# Altium schematic sheet GZ7_1_x-TEL.SchDoc: GZ8-4-0
size B; SheetNumber: 10; SheetTotal: 10
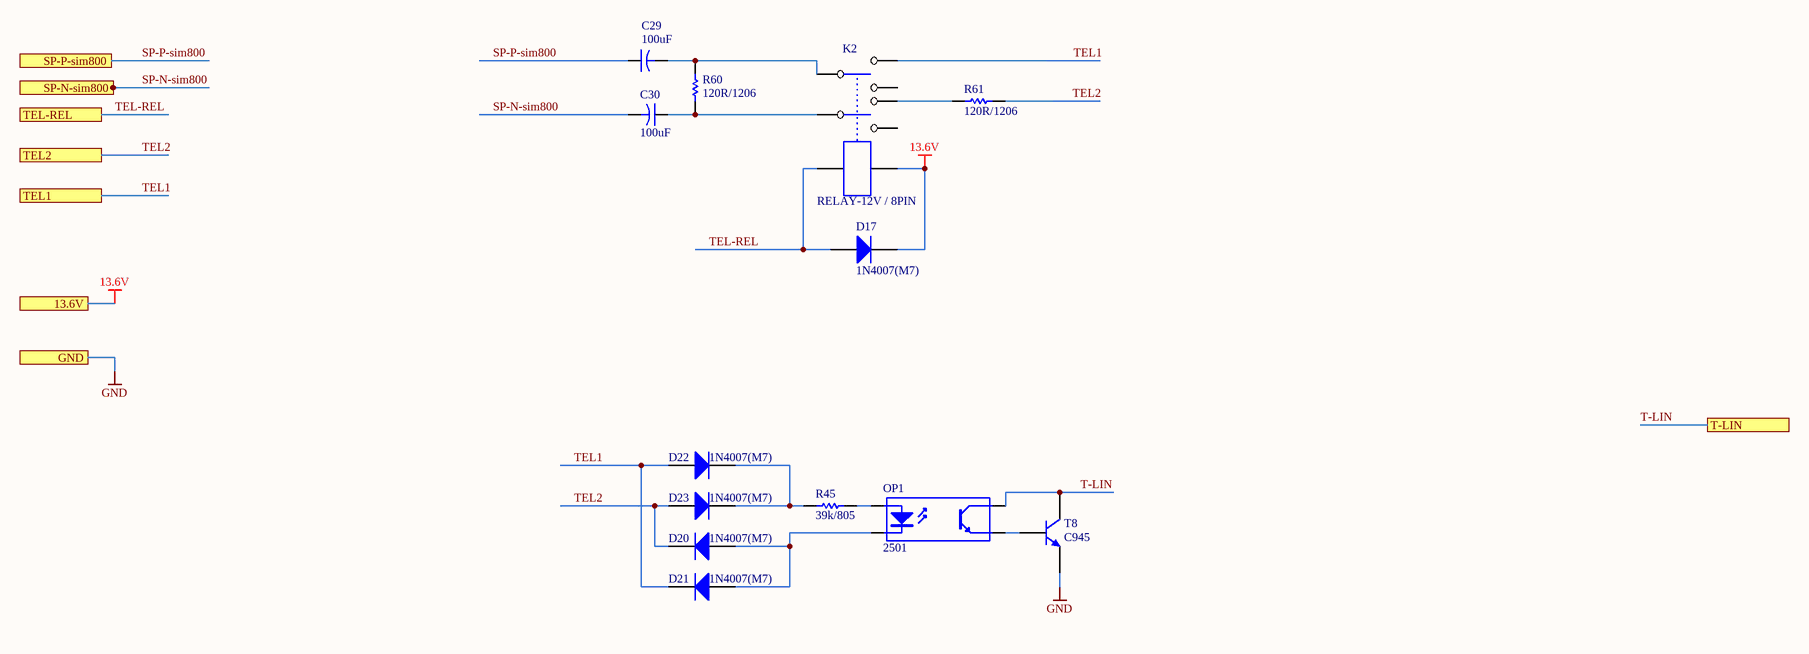
[diagram p0: GZ7_1_x-TEL.SchDoc]

## Parts
C29  value 100uF  [CAP ELECTROLITIC RADIAL 6X7-2.5]  (hidden comment: 100uF/25V)
C30  value 100uF  [CAP ELECTROLITIC RADIAL 6X7-2.5]  (hidden comment: 100uF/25V)
D17  1N4007(M7)  [Diode 1N4007 SMD]
D20  1N4007(M7)  [Diode 1N4007 SMD]
D21  1N4007(M7)  [Diode 1N4007 SMD]
D22  1N4007(M7)  [Diode 1N4007 SMD]
D23  1N4007(M7)  [Diode 1N4007 SMD]
K2  RELAY-12V / 8PIN  [MY_REL2]
OP1  2501  [SMT Gullwing Lead-Form]
R45  39k/805  [my805]
R60  120R/1206  [my1206]
R61  120R/1206  [my1206]
T8  C945  [SOT23_N]

## Ports
13.6V, GND, SP-N-sim800, SP-P-sim800, T-LIN, TEL1, TEL2, TEL-REL

## Nets
13.6V: D17.2(K) K2.8 ; port 13.6V
GND: T8.2(E) ; port GND
SP-N-sim800: C30.2 ; port SP-N-sim800
SP-P-sim800: C29.1 ; port SP-P-sim800
T-LIN: OP1.4(C) T8.3(C) ; port T-LIN
TEL1: D21.2(K) D22.1(A) K2.2 ; port TEL1
TEL2: D20.2(K) D23.1(A) R61.1 ; port TEL2
TEL-REL: D17.1(A) K2.7 ; port TEL-REL
NetC29_2: C29.2 K2.1 R60.2
NetC30_1: C30.1 K2.4 R60.1
NetD20_1: D20.1(A) D21.1(A) OP1.2(K)
NetD22_2: D22.2(K) D23.2(K) R45.1
NetK2_5: K2.5 R61.2
NetOP1_1: OP1.1(A) R45.2
NetOP1_3: OP1.3(E) T8.1(B)

Not connected (* = marked no-connect by the designer): K2 3 6

## Notes on the sheet
- SMART
- Serial Number:
- Revision:
- ALARM
- Sheet       of
- Title:
- Sheet Size: B
- Author:
- Approved By:
- Date:
- Drawn By:
- File:

## Library data of the parts
C29 C30 = Cap2: Cap electrolitic radial; Published: 23-Sep-2002; PackageReference: CAPR5-4X5; Publisher: Altium Limited
D17 D20-D23 = Diode 1N4007: Diode; Published: 8-Jun-2000; LatestRevisionDate: 17-Jul-2002; LatestRevisionNote: Re-released for DXP Platform.; DatasheetVersion: 1998; PackageVersion: Aug-1999; PackageReference: DO-41; Publisher: Altium Limited; Code_JEDEC: DO-204-AL; ComponentLink1Description: Manufacturer Link; ComponentLink1URL: http://www.fairchildsemi.com/; ComponentLink2Description: Datasheet; ComponentLink2URL: http://www.fairchildsemi.com/ds/1N%2F1N4001.pdf
K2 = RELAY-DPDT
OP1 = Optoisolator1: 4-Pin Optocoupler; Published: 24-Mar-1999; LatestRevisionDate: 04-Mar-2005; LatestRevisionNote: Sch pins 3 & 4 Swapped.; DatasheetVersion: Nov-2003; PackageReference: DIP-4; Publisher: Altium Limited
R45 = Res1: RES 805
R60 R61 = Res1: RES 805; Value: 10K; Published: 8-Jun-2000; LatestRevisionDate: 17-Jul-2002; LatestRevisionNote: Re-released for DXP Platform.; PackageReference: AXIAL-0.3; Publisher: Altium Limited
T8 = C945: SMD; Published: 2017-2-8; LatestRevisionDate: 2017; LatestRevisionNote: IPC-7351 Footprint Added.; DatasheetVersion: 2017; PackageVersion: 2017-2-8; PackageReference: SOT23; Publisher: Abbas Basereh; PackageDescription: 3-Pin SOT-23 Package 0.95 mm Pitch, 2.3 mm Lead Span; ComponentLink1Description: Manufacturer Link; ComponentLink1URL: http://www.taitroncomponents.com/; ComponentLink2Description: Datasheet; ComponentLink2URL: http://www.taitroncomponents.com/